# Altium schematic sheet new.SchDoc
size A4
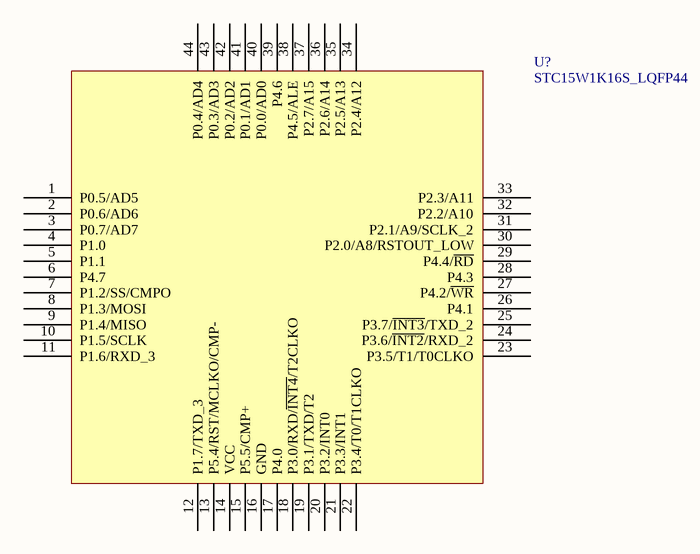
[diagram p0: new.SchDoc]

## Parts
U?  STC15W1K16S_LQFP44  [LQFP44]

## Nets

Not connected (* = marked no-connect by the designer): U? 1(P0.5/AD5) 2(P0.6/AD6) 3(P0.7/AD7) 4(P1.0) 5(P1.1) 6(P4.7) 7(P1.2/SS/CMPO) 8(P1.3/MOSI) 9(P1.4/MISO) 10(P1.5/SCLK) 11(P1.6/RXD_3) 12(P1.7/TXD_3) 13(P5.4/RST/MCLKO/CMP-) 14(VCC) 15(P5.5/CMP+) 16(GND) 17(P4.0) 18(P3.0/RXD/~{INT4}/T2CLKO) 19(P3.1/TXD/T2) 20(P3.2/INT0) 21(P3.3/INT1) 22(P3.4/T0/T1CLKO) 23(P3.5/T1/T0CLKO) 24(P3.6/~{INT2}/RXD_2) 25(P3.7/~{INT3}/TXD_2) 26(P4.1) 27(P4.2/~{WR}) 28(P4.3) 29(P4.4/~{RD}) 30(P2.0/A8/RSTOUT_LOW) 31(P2.1/A9/SCLK_2) 32(P2.2/A10) 33(P2.3/A11) 34(P2.4/A12) 35(P2.5/A13) 36(P2.6/A14) 37(P2.7/A15) 38(P4.5/ALE) 39(P4.6) 40(P0.0/AD0) 41(P0.1/AD1) 42(P0.2/AD2) 43(P0.3/AD3) 44(P0.4/AD4)